# EAGLE schematic 20150312_QSE_TO_FMC_with_DP_R5.3_for_review (EAGLE 7.2.0), part 2 of 2
## Module FMC1
Ports: GND(pwr) 3P3V_1(pwr) 3P3V_2(pwr) 3P3V_3(pwr) 3P3V_4(pwr) HA00_N_CC_N(io) HA00_P_CC_P(io) HA01_N_CC_N(io) HA01_P_CC_P(io) HA02_N(io) HA02_P(io) HA03_N(io) HA03_P(io) HA04_N(io) HA04_P(io) HA05_N(io) HA05_P(io) HA06_N(io) HA06_P(io) HA07_N(io) HA07_P(io) HA08_N(io) HA08_P(io) HA09_N(io) HA09_P(io) HA10_N(io) HA10_P(io) HA11_N(io) HA11_P(io) HA12_N(io) HA12_P(io) HA13_N(io) HA13_P(io) HA14_N(io) HA14_P(io) HA15_N(io) HA15_P(io) HA16_N(io) HA16_P(io) HA17_N_CC_N(io) HA17_P_CC_P(io) HA18_N(io) HA18_P(io) HA19_N(io) HA19_P(io) HA20_N(io) HA20_P(io) HA21_N(io) HA21_P(io) HA22_N(io) HA22_P(io) HA23_N(io) HA23_P(io) HB00_N_CC_N(io) HB00_P_CC_P(io) HB01_N(io) HB01_P(io) HB02_N(io) HB02_P(io) HB03_N(io) HB03_P(io) HB04_N(io) HB04_P(io) HB05_N(io) HB05_P(io) HB06_N_CC_N(io) HB06_P_CC_P(io) HB07_N(io) HB07_P(io) HB08_N(io) HB08_P(io) HB09_N(io) HB09_P(io) HB10_N(io) HB10_P(io) HB11_N(io) HB11_P(io) HB12_N(io) HB12_P(io) HB13_N(io) HB13_P(io) HB14_N(io) HB14_P(io) HB15_N(io) HB15_P(io) HB16_N(io) HB17_N_CC_N(io) HB17_P_CC_P(io) HB18_N(io) HB18_P(io) HB19_N(io) HB19_P(io) HB20_N(io) HB20_P(io) HB21_N(io) HB21_P(io) HB16_P(io) CLK2_M2C_N(io) CLK2_M2C_P(io) CLK3_M2C_N(io) CLK3_M2C_P(io) LA00_N_CC_N(io) LA00_P_CC_P(io) LA01_N_CC_N(io) LA01_P_CC_P(io) LA02_N(io) LA02_P(io) LA03_N(io) LA03_P(io) LA04_N(io) LA04_P(io) LA05_N(io) LA05_P(io) LA06_N(io) LA06_P(io) LA07_N(io) LA07_P(io) LA08_N(io) LA08_P(io) LA09_N(io) LA09_P(io) LA10_N(io) LA10_P(io) LA11_N(io) LA11_P(io) LA12_N(io) LA12_P(io) LA13_N(io) LA13_P(io) LA14_N(io) LA14_P(io) LA15_N(io) LA15_P(io) LA16_N(io) LA16_P(io) LA17_N_CC_N(io) LA17_P_CC_P(io) LA18_N_CC_N(io) LA18_P_CC_P(io) LA19_N(io) LA19_P(io) LA20_N(io) LA20_P(io) LA21_N(io) LA21_P(io) LA22_N(io) LA22_P(io) LA23_N(io) LA23_P(io) LA24_N(io) LA24_P(io) LA25_N(io) LA25_P(io) LA29_N(io) LA28_N(io) LA28_P(io) LA29_P(io) LA26_N(io) LA26_P(io) LA27_N(io) LA27_P(io) VIO_B_M2C_1(io) VIO_B_M2C_2(io) LA30_N(io) LA30_P(io) LA31_N(io) LA31_P(io) PRSNT_M2C_L(in) PG_M2C(in) VREF_A_M2C(io) VREF_B_M2C(io) LA32_N(io) LA32_P(io) LA33_N(io) LA33_P(io) DP0_M2C_N(in) DP0_M2C_P(in) DP1_M2C_N(in) DP1_M2C_P(in) DP2_M2C_N(in) DP2_M2C_P(in) DP3_M2C_N(in) DP3_M2C_P(in)
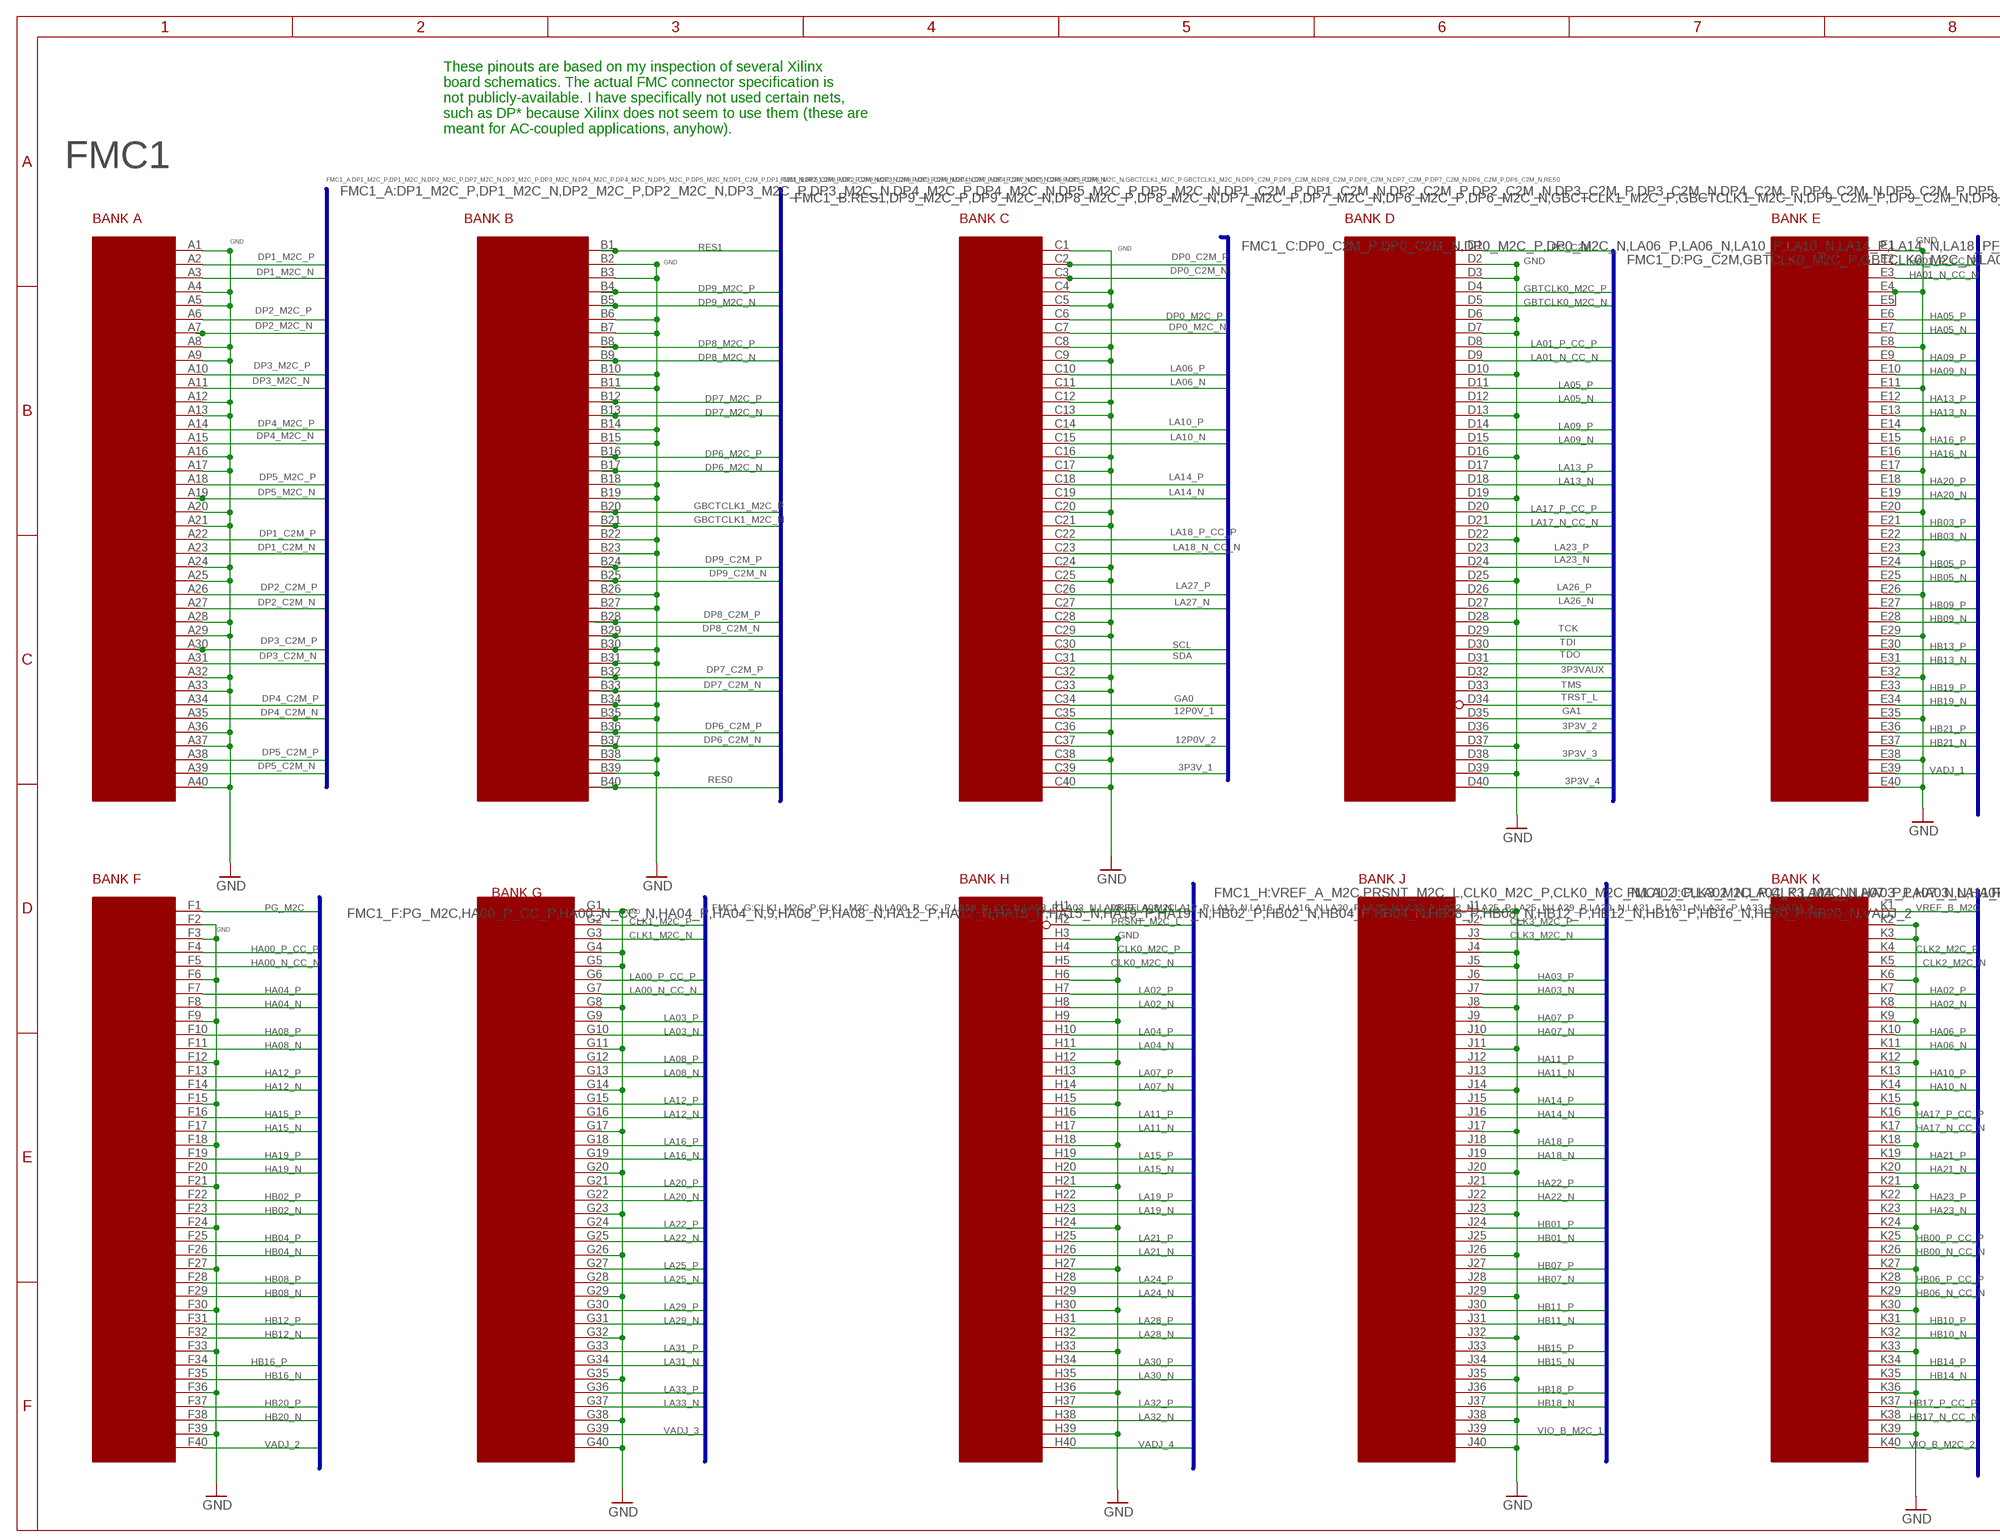
[diagram p4: schematic, module FMC1, sheet 1, part 1 of 2]
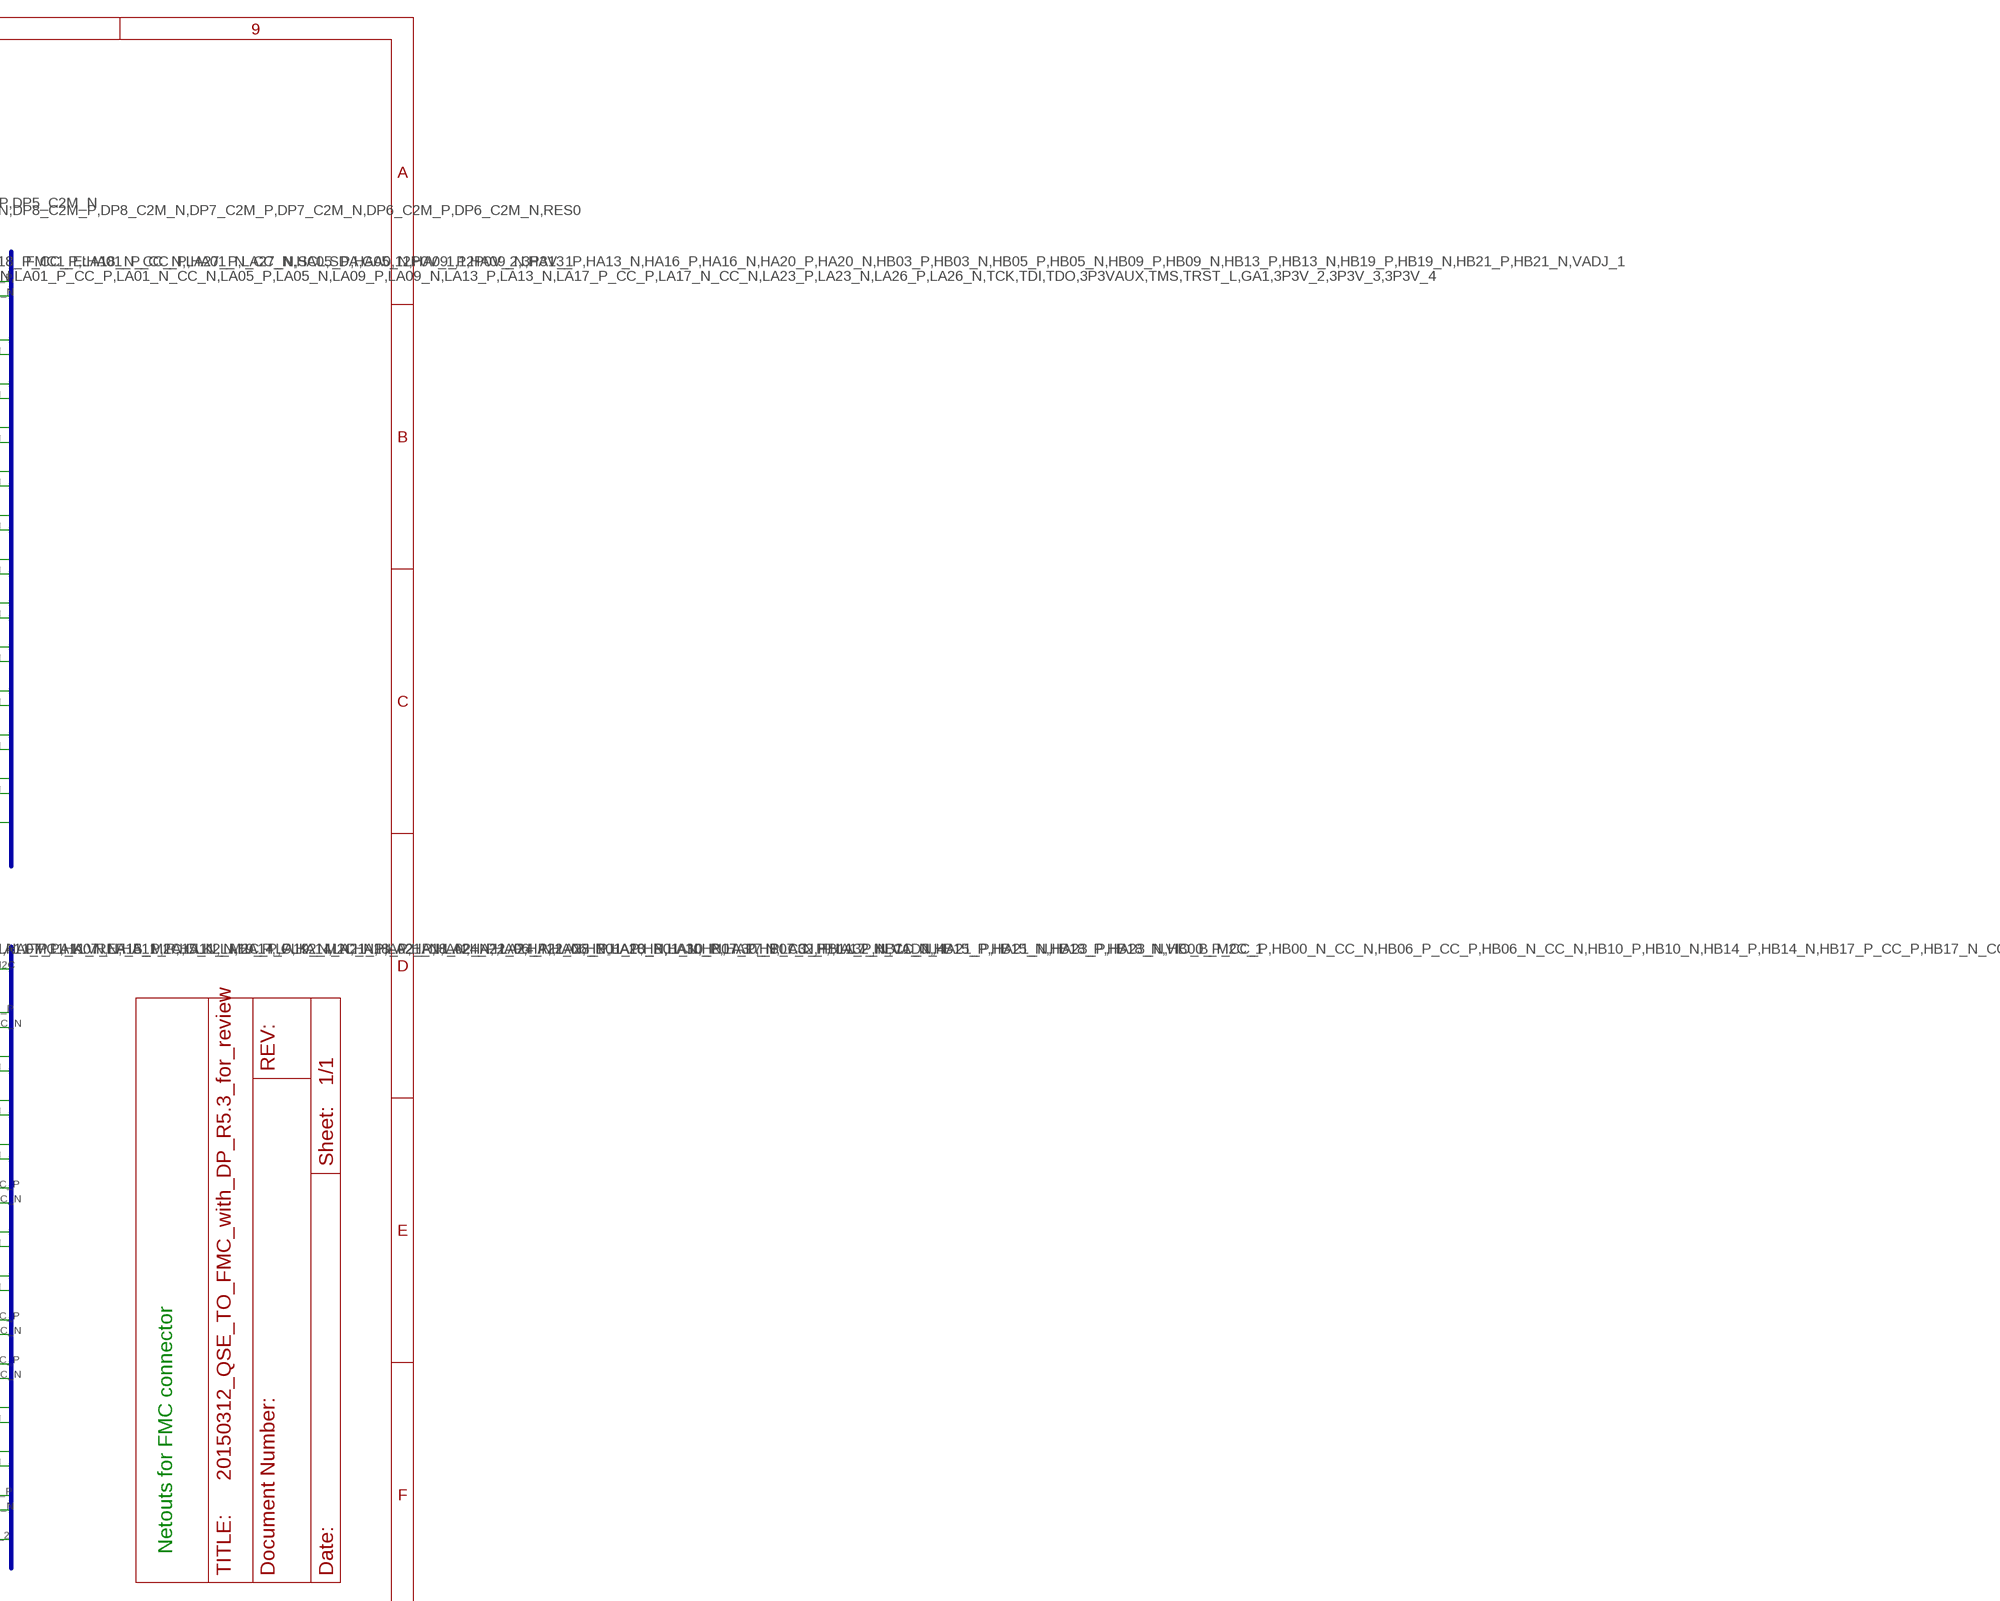
[diagram p5: schematic, module FMC1, sheet 1, part 2 of 2]

### Parts
FMC1  >NAME  ASP-134486-01  [SEAF-40-10]

### Nets
3P3V_1 [power]: FMC1.C39(Q$C39)
3P3V_2 [power]: FMC1.D36(Q$D36)
3P3V_3 [power]: FMC1.D38(Q$D38)
3P3V_4 [power]: FMC1.D40(Q$D40)
3P3VAUX [power]: FMC1.D32(Q$D32)
12P0V_1 [power]: FMC1.C35(Q$C35)
12P0V_2 [power]: FMC1.C37(Q$C37)
CLK0_M2C_N: FMC1.H5(S$H5)
CLK0_M2C_P [diff_sig]: FMC1.H4(S$H4)
CLK1_M2C_N [diff_sig]: FMC1.G3(S$G3)
CLK1_M2C_P [diff_sig]: FMC1.G2(S$G2)
CLK2_M2C_N [diff_sig]: FMC1.K5(T$K5)
CLK2_M2C_P [diff_sig]: FMC1.K4(T$K4)
CLK3_M2C_N [diff_sig]: FMC1.J3(T$J3)
CLK3_M2C_P [diff_sig]: FMC1.J2(T$J2)
DP0_C2M_N [diff_sig]: FMC1.C3(Q$C3)
DP0_C2M_P [diff_sig]: FMC1.C2(Q$C2)
DP0_M2C_N [diff_sig]: FMC1.C7(Q$C7)
DP0_M2C_P: FMC1.C6(Q$C6)
DP1_C2M_N [diff_sig]: FMC1.A23(P$A23)
DP1_C2M_P [diff_sig]: FMC1.A22(P$A22)
DP1_M2C_N [diff_sig]: FMC1.A3(P$A3)
DP1_M2C_P [diff_sig]: FMC1.A2(P$A2)
DP2_C2M_N [diff_sig]: FMC1.A27(P$A27)
DP2_C2M_P [diff_sig]: FMC1.A26(P$A26)
DP2_M2C_N [diff_sig]: FMC1.A7(P$A7)
DP2_M2C_P [diff_sig]: FMC1.A6(P$A6)
DP3_C2M_N [diff_sig]: FMC1.A31(P$A31)
DP3_C2M_P [diff_sig]: FMC1.A30(P$A30)
DP3_M2C_N [diff_sig]: FMC1.A11(P$A11)
DP3_M2C_P [diff_sig]: FMC1.A10(P$A10)
DP4_C2M_N [diff_sig]: FMC1.A35(P$A35)
DP4_C2M_P [diff_sig]: FMC1.A34(P$A34)
DP4_M2C_N [diff_sig]: FMC1.A15(P$A15)
DP4_M2C_P [diff_sig]: FMC1.A14(P$A14)
DP5_C2M_N [diff_sig]: FMC1.A39(P$A39)
DP5_C2M_P [diff_sig]: FMC1.A38(P$A38)
DP5_M2C_N [diff_sig]: FMC1.A19(P$A19)
DP5_M2C_P [diff_sig]: FMC1.A18(P$A18)
DP6_C2M_N [diff_sig]: FMC1.B37(P$B37)
DP6_C2M_P [diff_sig]: FMC1.B36(P$B36)
DP6_M2C_N [diff_sig]: FMC1.B17(P$B17)
DP6_M2C_P [diff_sig]: FMC1.B16(P$B16)
DP7_C2M_N [diff_sig]: FMC1.B33(P$B33)
DP7_C2M_P [diff_sig]: FMC1.B32(P$B32)
DP7_M2C_N [diff_sig]: FMC1.B13(P$B13)
DP7_M2C_P [diff_sig]: FMC1.B12(P$B12)
DP8_C2M_N [diff_sig]: FMC1.B29(P$B29)
DP8_C2M_P [diff_sig]: FMC1.B28(P$B28)
DP8_M2C_N [diff_sig]: FMC1.B9(P$B9)
DP8_M2C_P [diff_sig]: FMC1.B8(P$B8)
DP9_C2M_N [diff_sig]: FMC1.B25(P$B25)
DP9_C2M_P [diff_sig]: FMC1.B24(P$B24)
DP9_M2C_N [diff_sig]: FMC1.B5(P$B5)
DP9_M2C_P [diff_sig]: FMC1.B4(P$B4)
GA0 [gen_sig]: FMC1.C34(Q$C34)
GA1 [gen_sig]: FMC1.D35(Q$D35)
GBCTCLK1_M2C_N [diff_sig]: FMC1.B21(P$B21)
GBCTCLK1_M2C_P [diff_sig]: FMC1.B20(P$B20)
GBTCLK0_M2C_N [diff_sig]: FMC1.D5(Q$D5)
GBTCLK0_M2C_P [diff_sig]: FMC1.D4(Q$D4)
GND [diff_sig]: FMC1.A1(P$A1) FMC1.A4(P$A4) FMC1.A5(P$A5) FMC1.A8(P$A8) FMC1.A9(P$A9) FMC1.A12(P$A12) FMC1.A13(P$A13) FMC1.A16(P$A16) FMC1.A17(P$A17) FMC1.A20(P$A20) FMC1.A21(P$A21) FMC1.A24(P$A24) FMC1.A25(P$A25) FMC1.A28(P$A28) FMC1.A29(P$A29) FMC1.A32(P$A32) FMC1.A33(P$A33) FMC1.A36(P$A36) FMC1.A37(P$A37) FMC1.A40(P$A40) FMC1.B2(P$B2) FMC1.B3(P$B3) FMC1.B6(P$B6) FMC1.B7(P$B7) FMC1.B10(P$B10) FMC1.B11(P$B11) FMC1.B14(P$B14) FMC1.B15(P$B15) FMC1.B18(P$B18) FMC1.B19(P$B19) FMC1.B22(P$B22) FMC1.B23(P$B23) FMC1.B26(P$B26) FMC1.B27(P$B27) FMC1.B30(P$B30) FMC1.B31(P$B31) FMC1.B34(P$B34) FMC1.B35(P$B35) FMC1.B38(P$B38) FMC1.B39(P$B39) FMC1.C1(Q$C1) FMC1.C4(Q$C4) FMC1.C5(Q$C5) FMC1.C8(Q$C8) FMC1.C9(Q$C9) FMC1.C12(Q$C12) FMC1.C13(Q$C13) FMC1.C16(Q$C16) FMC1.C17(Q$C17) FMC1.C20(Q$C20) FMC1.C21(Q$C21) FMC1.C24(Q$C24) FMC1.C25(Q$C25) FMC1.C28(Q$C28) FMC1.C29(Q$C29) FMC1.C32(Q$C32) FMC1.C33(Q$C33) FMC1.C36(Q$C36) FMC1.C38(Q$C38) FMC1.C40(Q$C40) FMC1.D2(Q$D2) FMC1.D3(Q$D3) FMC1.D6(Q$D6) FMC1.D7(Q$D7) FMC1.D10(Q$D10) FMC1.D13(Q$D13) FMC1.D16(Q$D16) FMC1.D19(Q$D19) FMC1.D22(Q$D22) FMC1.D25(Q$D25) FMC1.D28(Q$D28) FMC1.D37(Q$D37) FMC1.D39(Q$D39) FMC1.E1(R$E1) FMC1.E4(R$E4) FMC1.E5(R$E5) FMC1.E8(R$E8) FMC1.E11(R$E11) FMC1.E14(R$E14) FMC1.E17(R$E17) FMC1.E20(R$E20) FMC1.E23(R$E23) FMC1.E26(R$E26) FMC1.E29(R$E29) FMC1.E32(R$E32) FMC1.E35(R$E35) FMC1.E38(R$E38) FMC1.E40(R$E40) FMC1.F2(R$F2) FMC1.F3(R$F3) FMC1.F6(R$F6) FMC1.F9(R$F9) FMC1.F12(R$F12) FMC1.F15(R$F15) FMC1.F18(R$F18) FMC1.F21(R$F21) FMC1.F24(R$F24) FMC1.F27(R$F27) FMC1.F30(R$F30) FMC1.F33(R$F33) FMC1.F36(R$F36) FMC1.F39(R$F39) FMC1.G1(S$G1) FMC1.G4(S$G4) FMC1.G5(S$G5) FMC1.G8(S$G8) FMC1.G11(S$G11) FMC1.G14(S$G14) FMC1.G17(S$G17) FMC1.G20(S$G20) FMC1.G23(S$G23) FMC1.G26(S$G26) FMC1.G29(S$G29) FMC1.G32(S$G32) FMC1.G35(S$G35) FMC1.G38(S$G38) FMC1.G40(S$G40) FMC1.H3(S$H3) FMC1.H6(S$H6) FMC1.H9(S$H9) FMC1.H12(S$H12) FMC1.H15(S$H15) FMC1.H18(S$H18) FMC1.H21(S$H21) FMC1.H24(S$H24) FMC1.H27(S$H27) FMC1.H30(S$H30) FMC1.H33(S$H33) FMC1.H36(S$H36) FMC1.H39(S$H39) FMC1.J1(T$J1) FMC1.J4(T$J4) FMC1.J5(T$J5) FMC1.J8(T$J8) FMC1.J11(T$J11) FMC1.J14(T$J14) FMC1.J17(T$J17) FMC1.J20(T$J20) FMC1.J23(T$J23) FMC1.J26(T$J26) FMC1.J29(T$J29) FMC1.J32(T$J32) FMC1.J35(T$J35) FMC1.J38(T$J38) FMC1.J40(T$J40) FMC1.K2(T$K2) FMC1.K3(T$K3) FMC1.K6(T$K6) FMC1.K9(T$K9) FMC1.K12(T$K12) FMC1.K15(T$K15) FMC1.K18(T$K18) FMC1.K21(T$K21) FMC1.K24(T$K24) FMC1.K27(T$K27) FMC1.K30(T$K30) FMC1.K33(T$K33) FMC1.K36(T$K36) FMC1.K39(T$K39)
HA00_N_CC_N [diff_sig]: FMC1.F5(R$F5)
HA00_P_CC_P [diff_sig]: FMC1.F4(R$F4)
HA01_N_CC_N [diff_sig]: FMC1.E3(R$E3)
HA01_P_CC_P [diff_sig]: FMC1.E2(R$E2)
HA02_N [diff_sig]: FMC1.K8(T$K8)
HA02_P [diff_sig]: FMC1.K7(T$K7)
HA03_N [diff_sig]: FMC1.J7(T$J7)
HA03_P [diff_sig]: FMC1.J6(T$J6)
HA04_N [diff_sig]: FMC1.F8(R$F8)
HA04_P [diff_sig]: FMC1.F7(R$F7)
HA05_N [diff_sig]: FMC1.E7(R$E7)
HA05_P [diff_sig]: FMC1.E6(R$E6)
HA06_N [diff_sig]: FMC1.K11(T$K11)
HA06_P [diff_sig]: FMC1.K10(T$K10)
HA07_N [diff_sig]: FMC1.J10(T$J10)
HA07_P [diff_sig]: FMC1.J9(T$J9)
HA08_N [diff_sig]: FMC1.F11(R$F11)
HA08_P [diff_sig]: FMC1.F10(R$F10)
HA09_N [diff_sig]: FMC1.E10(R$E10)
HA09_P [diff_sig]: FMC1.E9(R$E9)
HA10_N [diff_sig]: FMC1.K14(T$K14)
HA10_P [diff_sig]: FMC1.K13(T$K13)
HA11_N [diff_sig]: FMC1.J13(T$J13)
HA11_P [diff_sig]: FMC1.J12(T$J12)
HA12_N [diff_sig]: FMC1.F14(R$F14)
HA12_P [diff_sig]: FMC1.F13(R$F13)
HA13_N [diff_sig]: FMC1.E13(R$E13)
HA13_P [diff_sig]: FMC1.E12(R$E12)
HA14_N [diff_sig]: FMC1.J16(T$J16)
HA14_P [diff_sig]: FMC1.J15(T$J15)
HA15_N [diff_sig]: FMC1.F17(R$F17)
HA15_P [diff_sig]: FMC1.F16(R$F16)
HA16_N [diff_sig]: FMC1.E16(R$E16)
HA16_P [diff_sig]: FMC1.E15(R$E15)
HA17_N_CC_N [diff_sig]: FMC1.K17(T$K17)
HA17_P_CC_P [diff_sig]: FMC1.K16(T$K16)
HA18_N [diff_sig]: FMC1.J19(T$J19)
HA18_P [diff_sig]: FMC1.J18(T$J18)
HA19_N [diff_sig]: FMC1.F20(R$F20)
HA19_P [diff_sig]: FMC1.F19(R$F19)
HA20_N [diff_sig]: FMC1.E19(R$E19)
HA20_P [diff_sig]: FMC1.E18(R$E18)
HA21_N [diff_sig]: FMC1.K20(T$K20)
HA21_P [diff_sig]: FMC1.K19(T$K19)
HA22_N [diff_sig]: FMC1.J22(T$J22)
HA22_P [diff_sig]: FMC1.J21(T$J21)
HA23_N [diff_sig]: FMC1.K23(T$K23)
HA23_P [diff_sig]: FMC1.K22(T$K22)
HB00_N_CC_N [diff_sig]: FMC1.K26(T$K26)
HB00_P_CC_P [diff_sig]: FMC1.K25(T$K25)
HB01_N [diff_sig]: FMC1.J25(T$J25)
HB01_P [diff_sig]: FMC1.J24(T$J24)
HB02_N [diff_sig]: FMC1.F23(R$F23)
HB02_P [diff_sig]: FMC1.F22(R$F22)
HB03_N [diff_sig]: FMC1.E22(R$E22)
HB03_P [diff_sig]: FMC1.E21(R$E21)
HB04_N [diff_sig]: FMC1.F26(R$F26)
HB04_P [diff_sig]: FMC1.F25(R$F25)
HB05_N [diff_sig]: FMC1.E25(R$E25)
HB05_P [diff_sig]: FMC1.E24(R$E24)
HB06_N_CC_N [diff_sig]: FMC1.K29(T$K29)
HB06_P_CC_P [diff_sig]: FMC1.K28(T$K28)
HB07_N [diff_sig]: FMC1.J28(T$J28)
HB07_P [diff_sig]: FMC1.J27(T$J27)
HB08_N [diff_sig]: FMC1.F29(R$F29)
HB08_P [diff_sig]: FMC1.F28(R$F28)
HB09_N [diff_sig]: FMC1.E28(R$E28)
HB09_P [diff_sig]: FMC1.E27(R$E27)
HB10_N [diff_sig]: FMC1.K32(T$K32)
HB10_P [diff_sig]: FMC1.K31(T$K31)
HB11_N [diff_sig]: FMC1.J31(T$J31)
HB11_P [diff_sig]: FMC1.J30(T$J30)
HB12_N [diff_sig]: FMC1.F32(R$F32)
HB12_P [diff_sig]: FMC1.F31(R$F31)
HB13_N [diff_sig]: FMC1.E31(R$E31)
HB13_P [diff_sig]: FMC1.E30(R$E30)
HB14_N [diff_sig]: FMC1.K35(T$K35)
HB14_P [diff_sig]: FMC1.K34(T$K34)
HB15_N [diff_sig]: FMC1.J34(T$J34)
HB15_P [diff_sig]: FMC1.J33(T$J33)
HB16_N [diff_sig]: FMC1.F35(R$F35)
HB16_P [diff_sig]: FMC1.F34(R$F34)
HB17_N_CC_N [diff_sig]: FMC1.K38(T$K38)
HB17_P_CC_P [diff_sig]: FMC1.K37(T$K37)
HB18_N [diff_sig]: FMC1.J37(T$J37)
HB18_P [diff_sig]: FMC1.J36(T$J36)
HB19_N [diff_sig]: FMC1.E34(R$E34)
HB19_P [diff_sig]: FMC1.E33(R$E33)
HB20_N [diff_sig]: FMC1.F38(R$F38)
HB20_P [diff_sig]: FMC1.F37(R$F37)
HB21_N [diff_sig]: FMC1.E37(R$E37)
HB21_P [diff_sig]: FMC1.E36(R$E36)
LA00_N_CC_N [diff_sig]: FMC1.G7(S$G7)
LA00_P_CC_P [diff_sig]: FMC1.G6(S$G6)
LA01_N_CC_N [diff_sig]: FMC1.D9(Q$D9)
LA01_P_CC_P [diff_sig]: FMC1.D8(Q$D8)
LA02_N [diff_sig]: FMC1.H8(S$H8)
LA02_P [diff_sig]: FMC1.H7(S$H7)
LA03_N [diff_sig]: FMC1.G10(S$G10)
LA03_P [diff_sig]: FMC1.G9(S$G9)
LA04_N [diff_sig]: FMC1.H11(S$H11)
LA04_P [diff_sig]: FMC1.H10(S$H10)
LA05_N [diff_sig]: FMC1.D12(Q$D12)
LA05_P [diff_sig]: FMC1.D11(Q$D11)
LA06_N [diff_sig]: FMC1.C11(Q$C11)
LA06_P [diff_sig]: FMC1.C10(Q$C10)
LA07_N [diff_sig]: FMC1.H14(S$H14)
LA07_P [diff_sig]: FMC1.H13(S$H13)
LA08_N [diff_sig]: FMC1.G13(S$G13)
LA08_P [diff_sig]: FMC1.G12(S$G12)
LA09_N [diff_sig]: FMC1.D15(Q$D15)
LA09_P [diff_sig]: FMC1.D14(Q$D14)
LA10_N [diff_sig]: FMC1.C15(Q$C15)
LA10_P [diff_sig]: FMC1.C14(Q$C14)
LA11_N [diff_sig]: FMC1.H17(S$H17)
LA11_P [diff_sig]: FMC1.H16(S$H16)
LA12_N [diff_sig]: FMC1.G16(S$G16)
LA12_P [diff_sig]: FMC1.G15(S$G15)
LA13_N [diff_sig]: FMC1.D18(Q$D18)
LA13_P [diff_sig]: FMC1.D17(Q$D17)
LA14_N [diff_sig]: FMC1.C19(Q$C19)
LA14_P [diff_sig]: FMC1.C18(Q$C18)
LA15_N [diff_sig]: FMC1.H20(S$H20)
LA15_P [diff_sig]: FMC1.H19(S$H19)
LA16_N [diff_sig]: FMC1.G19(S$G19)
LA16_P [diff_sig]: FMC1.G18(S$G18)
LA17_N_CC_N [diff_sig]: FMC1.D21(Q$D21)
LA17_P_CC_P [diff_sig]: FMC1.D20(Q$D20)
LA18_N_CC_N [diff_sig]: FMC1.C23(Q$C23)
LA18_P_CC_P [diff_sig]: FMC1.C22(Q$C22)
LA19_N [diff_sig]: FMC1.H23(S$H23)
LA19_P [diff_sig]: FMC1.H22(S$H22)
LA20_N [diff_sig]: FMC1.G22(S$G22)
LA20_P [diff_sig]: FMC1.G21(S$G21)
LA21_N [diff_sig]: FMC1.H26(S$H26)
LA21_P [diff_sig]: FMC1.H25(S$H25)
LA22_N [diff_sig]: FMC1.G25(S$G25)
LA22_P [diff_sig]: FMC1.G24(S$G24)
LA23_N [diff_sig]: FMC1.D24(Q$D24)
LA23_P [diff_sig]: FMC1.D23(Q$D23)
LA24_N [diff_sig]: FMC1.H29(S$H29)
LA24_P [diff_sig]: FMC1.H28(S$H28)
LA25_N [diff_sig]: FMC1.G28(S$G28)
LA25_P [diff_sig]: FMC1.G27(S$G27)
LA26_N [diff_sig]: FMC1.D27(Q$D27)
LA26_P [diff_sig]: FMC1.D26(Q$D26)
LA27_N [diff_sig]: FMC1.C27(Q$C27)
LA27_P [diff_sig]: FMC1.C26(Q$C26)
LA28_N [diff_sig]: FMC1.H32(S$H32)
LA28_P [diff_sig]: FMC1.H31(S$H31)
LA29_N [diff_sig]: FMC1.G31(S$G31)
LA29_P [diff_sig]: FMC1.G30(S$G30)
LA30_N [diff_sig]: FMC1.H35(S$H35)
LA30_P [diff_sig]: FMC1.H34(S$H34)
LA31_N [diff_sig]: FMC1.G34(S$G34)
LA31_P [diff_sig]: FMC1.G33(S$G33)
LA32_N [diff_sig]: FMC1.H38(S$H38)
LA32_P [diff_sig]: FMC1.H37(S$H37)
LA33_N [diff_sig]: FMC1.G37(S$G37)
LA33_P [diff_sig]: FMC1.G36(S$G36)
PG_C2M [diff_sig]: FMC1.D1(Q$D1)
PG_M2C [gen_sig]: FMC1.F1(R$F1)
PRSNT_M2C_L [diff_sig]: FMC1.H2(S$H2)
RES0: FMC1.B40(P$B40)
RES1: FMC1.B1(P$B1)
SCL [gen_sig]: FMC1.C30(Q$C30)
SDA [gen_sig]: FMC1.C31(Q$C31)
TCK [gen_sig]: FMC1.D29(Q$D29)
TDI [gen_sig]: FMC1.D30(Q$D30)
TDO [gen_sig]: FMC1.D31(Q$D31)
TMS [gen_sig]: FMC1.D33(Q$D33)
TRST_L: FMC1.D34(Q$D34)
VADJ_1 [diff_top]: FMC1.E39(R$E39)
VADJ_2 [diff_top]: FMC1.F40(R$F40)
VADJ_3 [diff_top]: FMC1.G39(S$G39)
VADJ_4 [diff_top]: FMC1.H40(S$H40)
VIO_B_M2C_1 [diff_top]: FMC1.J39(T$J39)
VIO_B_M2C_2 [diff_top]: FMC1.K40(T$K40)
VREF_A_M2C [diff_sig]: FMC1.H1(S$H1)
VREF_B_M2C [diff_top]: FMC1.K1(T$K1)

### Buses
FMC1_A:DP1_M2C_P,DP1_M2C_N,DP2_M2C_P,DP2_M2C_N,DP3_M2C_P,DP3_M2C_N,DP4_M2C_P,DP4_M2C_N,DP5_M2C_P,DP5_M2C_N,DP1_C2M_P,DP1_C2M_N,DP2_C2M_P,DP2_C2M_N,DP3_C2M_P,DP3_C2M_N,DP4_C2M_P,DP4_C2M_N,DP5_C2M_P,DP5_C2M_N
FMC1_B:RES1,DP9_M2C_P,DP9_M2C_N,DP8_M2C_P,DP8_M2C_N,DP7_M2C_P,DP7_M2C_N,DP6_M2C_P,DP6_M2C_N,GBCTCLK1_M2C_P,GBCTCLK1_M2C_N,DP9_C2M_P,DP9_C2M_N,DP8_C2M_P,DP8_C2M_N,DP7_C2M_P,DP7_C2M_N,DP6_C2M_P,DP6_C2M_N,RES0
FMC1_C:DP0_C2M_P,DP0_C2M_N,DP0_M2C_P,DP0_M2C_N,LA06_P,LA06_N,LA10_P,LA10_N,LA14_P,LA14_N,LA18_P_CC_P,LA18_N_CC_N,LA27_P,LA27_N,SCL,SDA,GA0,12P0V_1,12P0V_2,3P3V_1
FMC1_D:PG_C2M,GBTCLK0_M2C_P,GBTCLK0_M2C_N,LA01_P_CC_P,LA01_N_CC_N,LA05_P,LA05_N,LA09_P,LA09_N,LA13_P,LA13_N,LA17_P_CC_P,LA17_N_CC_N,LA23_P,LA23_N,LA26_P,LA26_N,TCK,TDI,TDO,3P3VAUX,TMS,TRST_L,GA1,3P3V_2,3P3V_3,3P3V_4
FMC1_E:HA01_P_CC_P,HA01_N_CC_N,HA05_P,HA05_N,HA09_P,HA09_N,HA13_P,HA13_N,HA16_P,HA16_N,HA20_P,HA20_N,HB03_P,HB03_N,HB05_P,HB05_N,HB09_P,HB09_N,HB13_P,HB13_N,HB19_P,HB19_N,HB21_P,HB21_N,VADJ_1
FMC1_F:PG_M2C,HA00_P_CC_P,HA00_N_CC_N,HA04_P,HA04_N,9,HA08_P,HA08_N,HA12_P,HA12_N,HA15_P,HA15_N,HA19_P,HA19_N,HB02_P,HB02_N,HB04_P,HB04_N,HB08_P,HB08_N,HB12_P,HB12_N,HB16_P,HB16_N,HB20_P,HB20_N,VADJ_2
FMC1_G:CLK1_M2C_P,CLK1_M2C_N,LA00_P_CC_P,LA00_N_CC_N,LA03_P,LA03_N,LA08_P,LA08_N,LA12_P,LA12_N,LA16_P,LA16_N,LA20_P,LA20_N,LA22_P,LA22_N,LA25_P,LA25_N,LA29_P,LA29_N,LA31_P,LA31_N,LA33_P,LA33_N,VADJ_3
FMC1_H:VREF_A_M2C,PRSNT_M2C_L,CLK0_M2C_P,CLK0_M2C_N,LA02_P,LA02_N,LA04_P,LA04_N,LA07_P,LA07_N,LA11_P,LA11_N,LA15_P,LA15_N,LA19_P,LA19_N,LA21_P,LA21_N,LA24_P,LA24_N,LA28_P,LA28_N,LA30_P,LA30_N,LA32_P,LA32_N,VADJ_4
FMC1_J:CLK3_M2C_P,CLK3_M2C_N,HA03_P,HA03_N,HA07_P,HA07_N,HA11_P,HA11_N,HA14_P,HA14_N,HA18_P,HA18_N,HA22_P,HA22_N,HB01_P,HB01_N,HB07_P,HB07_N,HB11_P,HB11_N,HB15_P,HB15_N,HB18_P,HB18_N,VIO_B_M2C_1
FMC1_K:VREF_B_M2C,CLK2_M2C_P,CLK2_M2C_N,HA02_P,HA02_N,HA06_P,HA06_N,HA10_P,HA10_N,HA17_P_CC_P,HA17_N_CC_N,HA21_P,HA21_N,HA23_P,HA23_N,HB00_P_CC_P,HB00_N_CC_N,HB06_P_CC_P,HB06_N_CC_N,HB10_P,HB10_N,HB14_P,HB14_N,HB17_P_CC_P,HB17_N_CC_N,VIO_B_M2C_2

### Notes on the sheet
- These pinouts are based on my inspection of several Xilinx 
  board schematics. The actual FMC connector specification is
  not publicly-available. I have specifically not used certain nets, 
  such as DP* because Xilinx does not seem to use them (these are
  meant for AC-coupled applications, anyhow).
- Netouts for FMC connector

### Library data of the parts
FMC1 = con-samtec-qxe:ASP-134486-01; MPN: ASP-134486-01; OC_NEWARK: 79X1311

## Net classes
0 default: width 0.152 mm
1 gen_sig: width 0.102 mm, clearance 0.152 mm to class 0, clearance 0.152 mm
2 diff_sig: width 0.089 mm, drill 0.203 mm, clearance 0.305 mm to class 0, clearance 0.216 mm to class 1, clearance 0.216 mm
3 GND: width 0.25 mm, drill 0.203 mm, clearance 0.152 mm to class 0, clearance 0.152 mm to class 1, clearance 0.152 mm to class 2
4 power: width 0.254 mm, clearance 0.152 mm to class 0, clearance 0.152 mm to class 1, clearance 0.152 mm to class 2, clearance 0.152 mm to class 3, clearance 0.152 mm
5 diff_top: width 0.127 mm, drill 0.203 mm, clearance 0.305 mm to class 0, clearance 0.152 mm to class 1, clearance 0.152 mm to class 2, clearance 0.152 mm to class 3, clearance 0.152 mm to class 4, clearance 0.254 mm
6 diff_buried: width 0.102 mm, drill 0.203 mm, clearance 0.305 mm to class 0, clearance 0.305 mm to class 1, clearance 0.203 mm to class 2, clearance 0.305 mm to class 3, clearance 0.203 mm to class 4, clearance 0.203 mm to class 5, clearance 0.203 mm
8 DP: width 0.127 mm, drill 0.203 mm, clearance 0.178 mm